# Altium schematic sheet Example Board.SchDoc
size A; SheetNumber: 1; SheetTotal: 1
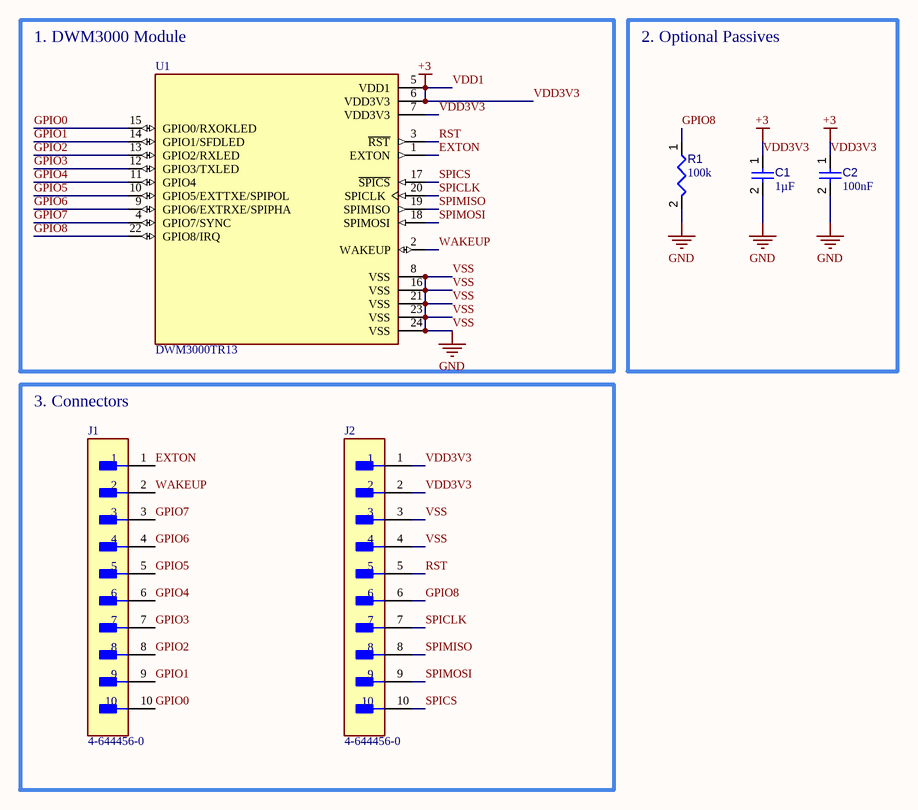
[diagram p0: Example Board.SchDoc]

## Parts
C1  value 1µF  [CAPC0402(1005)60_L]  (hidden comment: Capacitor 1µF +/-20% 10V 0402)
C2  value 100nF  [CAPC0402(1005)60_L]  (hidden comment: Capacitor 100nF +/-20% 25V 0402)
J1  4-644456-0  [FP-4-644456-0-MFG]
J2  4-644456-0  [FP-4-644456-0-MFG]
R1  value 100k  [RESC1608X55X25ML10T15]  (hidden comment: Resistor 100k +/-1% 0603 100 mW)
U1  DWM3000TR13  [XCVR_DWM3000TR13]

## Blocks framed on the sheet
1. DWM3000 Module: U1
2. Optional Passives: C1 C2 R1
3. Connectors: J1 J2

## Nets
VDD1: C1.1 C2.1 J2.1 J2.2 U1.5(VDD1) U1.6(VDD3V3) U1.7(VDD3V3)  [also labelled +3, VDD3V3]
VSS: C1.2 C2.2 J2.3 J2.4 R1.2 U1.8(VSS) U1.16(VSS) U1.21(VSS) U1.23(VSS) U1.24(VSS)  [also labelled GND]
EXTON: J1.1 U1.1(EXTON)
GPIO0: J1.10 U1.15(GPIO0/RXOKLED)
GPIO1: J1.9 U1.14(GPIO1/SFDLED)
GPIO2: J1.8 U1.13(GPIO2/RXLED)
GPIO3: J1.7 U1.12(GPIO3/TXLED)
GPIO4: J1.6 U1.11(GPIO4)
GPIO5: J1.5 U1.10(GPIO5/EXTTXE/SPIPOL)
GPIO6: J1.4 U1.9(GPIO6/EXTRXE/SPIPHA)
GPIO7: J1.3 U1.4(GPIO7/SYNC)
GPIO8: J2.6 R1.1 U1.22(GPIO8/IRQ)
RST: J2.5 U1.3(~{RST})
SPICLK: J2.7 U1.20(SPICLK)
SPICS: J2.10 U1.17(~{SPICS})
SPIMISO: J2.8 U1.19(SPIMISO)
SPIMOSI: J2.9 U1.18(SPIMOSI)
WAKEUP: J1.2 U1.2(WAKEUP)

## Library data of the parts
C1 = CMP-001-00063-3: Chip Capacitor, 1µF +/-20%, 10V, 0402, Thickness 0.6 mm; Tolerance: 10%; Mounting Technology: SMT; Max Operating Temperature: 85°C; Voltage Rating: 10V; Pins: 2; Case/Package: 0402; Min Operating Temperature: -55°C
C2 = CMP-001-00065-4: Chip Capacitor, 100nF +/-20%, 25V, 0402, Thickness 0.6 mm; Tolerance: 10%; Max Operating Temperature: 85°C; Min Operating Temperature: -55°C; Pins: 2; Voltage Rating: 25V; Mounting Technology: SMT; Case/Package: 0402
J1 J2 = CMP-002-00078-1: Conn Unshrouded Header HDR 10 POS 2.54mm Solder ST Top Entry Thru-Hole Bag/Box; Shrouded: No (Without); Voltage Rating (AC): 250V; Contact Resistance: 6mR; PCB Mounting Orientation: Vertical; Number of Positions: 10; PCB Thickness: 0.063inch; Gender: Male; Circuit Application: Signal; Contact Current Rating: 5A; Plating: Tin; Connector System: Wire-to-Board; Tail Length: 0.11inch; Contact Style: Straight; PCB Mount Retention: Without; Plating Thickness: 1.27um; Approvals: CSA; Underplate Material: Nickel; Connector Type: Plug,Header,Pin; Contact Gender: Male; Series: MTA-100; Depth: 2.33mm; Height: 10.03mm; Length: 25.1mm; Housing Color: Natural; RoHS Compliant: Yes; Packaging: Bag; Flammability Rating: UL94 V-0; Strain Relief: No (Without); Contact Shape: Square; Color: Natural; Radiation Hardening: No; Orientation: Straight; Lead Free: Lead Free; Contact Retention: No (Without); Contact Mating Length: 7.49mm; Termination: Solder; Pitch: 2.54mm; Mating Alignment: No (Without); Min Operating Temperature: -67°C; Current Rating: 5A; Number of Rows: 1; Contact Material: Copper Alloy; Mating Retention: No (Without); ELV: Compliant; Mounting Technology: Through Hole; Housing Material: Polyester; Contact Plating: Tin,Matte; Package Quantity: 500; Max Voltage Rating (AC): 250V; Operating Supply Voltage: 250V; Contact Type: Male Pin; Number of Contacts: 10; Voltage Rating: 250V; Backwall/Post Interruptions: No (Without); Sealable: No (Without); Max Operating Temperature: 221°C; PCB Mount Alignment: No (Without)
R1 = CMP-009-00023-5: Chip Resistor, 100 KOhm, +/- 1%, 0.1 W, -55 to 155 degC, 0603 (1608 Metric); Voltage Rating: 50V; Power: 100mW; Max Operating Temperature: 155°C; RoHS Compliant: True; Tolerance: 1%; Pins: 2; Case/Package: 0603; Mounting Technology: SM; Min Operating Temperature: -55°C
U1 = CMP-007-000000-1: RF Modules DW1000 based module; MF: Qorvo; Check_prices: https://www.snapeda.com/parts/DWM3000TR13/Qorvo/view-part/?ref=eda; MP: DWM3000TR13; Package: None; Design Item ID: DWM3000TR13; Value: *; Price: None; Source: DWM3000TR13.SchLib; SnapEDA_Link: https://www.snapeda.com/parts/DWM3000TR13/Qorvo/view-part/?ref=snap; Component Type: Standard; Purchase-URL: https://pricing.snapeda.com/search/part/DWM3000TR13/?ref=eda; Pin Count: 24; Availability: In Stock